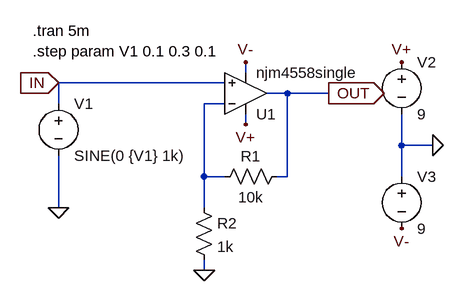
[diagram p0: schematic Circuit7_04.asc]
Circuit7_04.asc, the LTspice schematic file:
Version 4
SHEET 1 880 680
WIRE 160 240 160 224
WIRE 128 256 -128 256
WIRE 224 272 192 272
WIRE 288 272 224 272
WIRE -128 288 -128 256
WIRE 128 288 96 288
WIRE 160 320 160 304
WIRE 400 352 400 304
WIRE 448 352 400 352
WIRE 96 400 96 288
WIRE 128 400 96 400
WIRE 224 400 224 272
WIRE 224 400 208 400
WIRE 400 400 400 352
WIRE 96 448 96 400
WIRE -128 448 -128 368
WIRE 96 544 96 528
FLAG 448 352 0
FLAG -128 256 IN
IOPIN -128 256 In
FLAG 288 272 OUT
IOPIN 288 272 Out
FLAG -128 448 0
FLAG 160 320 V+
FLAG 160 224 V-
FLAG 400 224 V+
FLAG 400 480 V-
FLAG 96 544 0
SYMBOL voltage -128 272 R0
SYMATTR InstName V1
SYMATTR Value SINE(0 {V1} 1k)
SYMBOL voltage 400 208 R0
SYMATTR InstName V2
SYMATTR Value 9
SYMBOL voltage 400 384 R0
SYMATTR InstName V3
SYMATTR Value 9
SYMBOL res 224 384 R90
WINDOW 0 0 56 VBottom 2
WINDOW 3 32 56 VTop 2
SYMATTR InstName R1
SYMATTR Value 10k
SYMBOL res 80 432 R0
SYMATTR InstName R2
SYMATTR Value 1k
SYMBOL NJR_OPamp/njm4558single 160 336 M180
SYMATTR InstName U1
TEXT -168 176 Left 2 !.tran 5m\n.step param V1 0.1 0.3 0.1

The netlist it stands for:
* Circuit7_04.asc
V1 IN 0 SINE(0 {V1} 1k)
V2 V+ 0 9
V3 0 V- 9
R1 OUT N001 10k
R2 N001 0 1k
* U1: njm4558single (symbol NJR_OPamp/njm4558single not available, pins judged from their places): In+=IN In-=N001 V+=V+ V-=V- OUT=OUT
.tran 5m
.step param V1 0.1 0.3 0.1
.backanno
.end